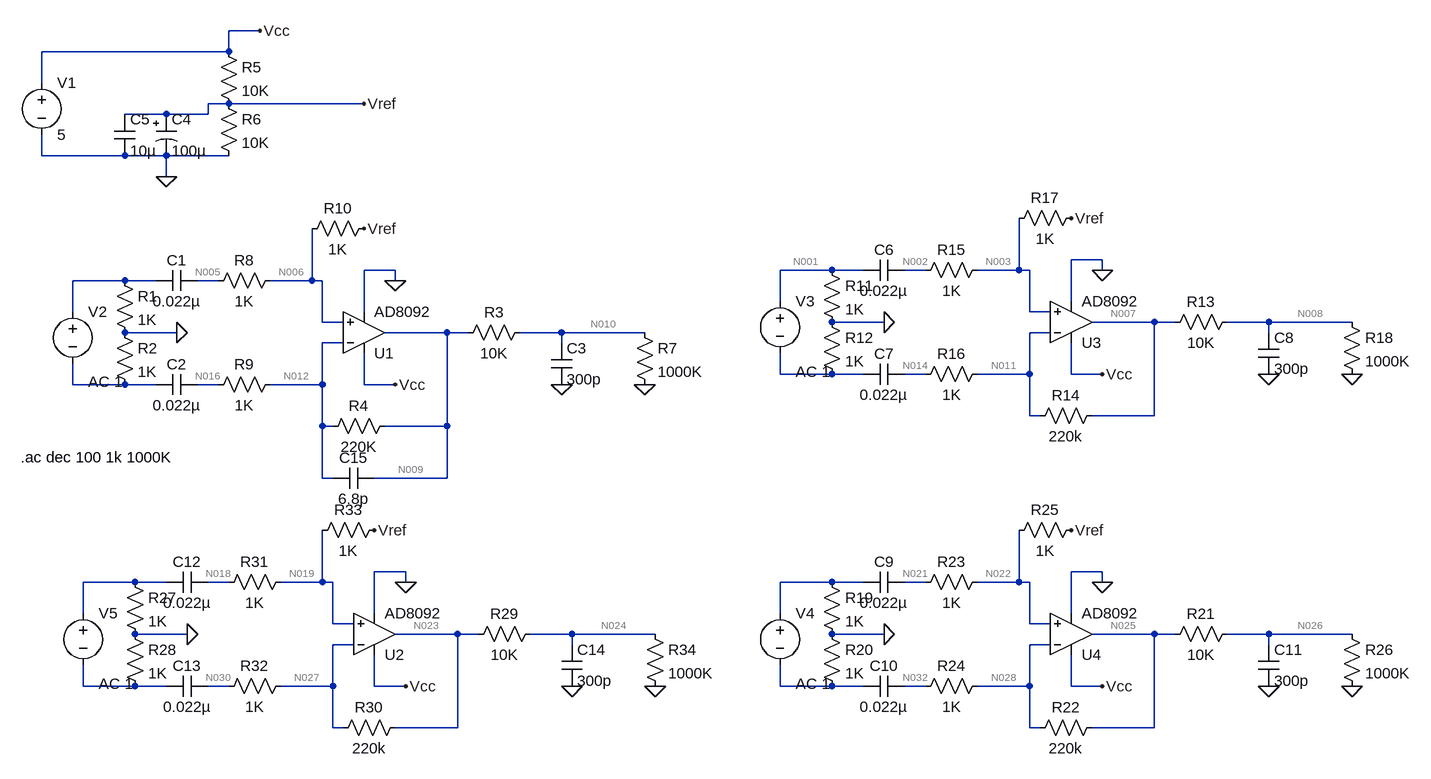
[diagram p0: schematic FilterRC.asc]
FilterRC.asc, the LTspice schematic file:
Version 4
SHEET 1 1920 816
WIRE 144 -304 96 -304
WIRE 96 -272 96 -304
WIRE 96 -272 -192 -272
WIRE -192 -224 -192 -272
WIRE 96 -192 64 -192
WIRE 304 -192 96 -192
WIRE 0 -176 -64 -176
WIRE 64 -176 64 -192
WIRE 64 -176 0 -176
WIRE -192 -112 -192 -144
WIRE -64 -112 -192 -112
WIRE 0 -112 -64 -112
WIRE 96 -112 0 -112
WIRE 0 -80 0 -112
WIRE 1440 48 1392 48
WIRE 352 64 304 64
WIRE 1024 64 944 64
WIRE 1072 64 1024 64
WIRE 1168 64 1136 64
WIRE 1312 64 1312 -16
WIRE 1312 64 1248 64
WIRE 1328 64 1312 64
WIRE 1440 64 1440 48
WIRE -64 80 -144 80
WIRE -16 80 -64 80
WIRE 80 80 48 80
WIRE 224 80 224 0
WIRE 224 80 160 80
WIRE 240 80 224 80
WIRE 352 80 352 64
WIRE 944 112 944 64
WIRE 1392 112 1392 48
WIRE -144 128 -144 80
WIRE 304 128 304 64
WIRE 1328 128 1328 64
WIRE 1360 128 1328 128
WIRE 240 144 240 80
WIRE 272 144 240 144
WIRE 1104 144 1024 144
WIRE 1520 144 1424 144
WIRE 1552 144 1520 144
WIRE 1696 144 1632 144
WIRE 1824 144 1696 144
WIRE 16 160 -64 160
WIRE 432 160 336 160
WIRE 464 160 432 160
WIRE 608 160 544 160
WIRE 736 160 608 160
WIRE 1360 160 1328 160
WIRE 1696 160 1696 144
WIRE 272 176 240 176
WIRE 608 176 608 160
WIRE 944 224 944 192
WIRE 1024 224 944 224
WIRE 1072 224 1024 224
WIRE 1168 224 1136 224
WIRE 1328 224 1328 160
WIRE 1328 224 1248 224
WIRE 1392 224 1392 176
WIRE 1440 224 1392 224
WIRE -144 240 -144 208
WIRE -64 240 -144 240
WIRE -16 240 -64 240
WIRE 80 240 48 240
WIRE 240 240 240 176
WIRE 240 240 160 240
WIRE 304 240 304 192
WIRE 352 240 304 240
WIRE 1328 288 1328 224
WIRE 1344 288 1328 288
WIRE 1520 288 1520 144
WIRE 1520 288 1424 288
WIRE 240 304 240 240
WIRE 256 304 240 304
WIRE 432 304 432 160
WIRE 432 304 336 304
WIRE 240 384 240 304
WIRE 256 384 240 384
WIRE 432 384 432 304
WIRE 432 384 320 384
WIRE 368 528 320 528
WIRE 1440 528 1392 528
WIRE -48 544 -128 544
WIRE 0 544 -48 544
WIRE 96 544 64 544
WIRE 240 544 240 464
WIRE 240 544 176 544
WIRE 256 544 240 544
WIRE 368 544 368 528
WIRE 1024 544 944 544
WIRE 1072 544 1024 544
WIRE 1168 544 1136 544
WIRE 1312 544 1312 464
WIRE 1312 544 1248 544
WIRE 1328 544 1312 544
WIRE 1440 544 1440 528
WIRE -128 592 -128 544
WIRE 320 592 320 528
WIRE 944 592 944 544
WIRE 1392 592 1392 528
WIRE 256 608 256 544
WIRE 288 608 256 608
WIRE 1328 608 1328 544
WIRE 1360 608 1328 608
WIRE 32 624 -48 624
WIRE 448 624 352 624
WIRE 480 624 448 624
WIRE 624 624 560 624
WIRE 752 624 624 624
WIRE 1104 624 1024 624
WIRE 1520 624 1424 624
WIRE 1552 624 1520 624
WIRE 1696 624 1632 624
WIRE 1824 624 1696 624
WIRE 288 640 256 640
WIRE 624 640 624 624
WIRE 1360 640 1328 640
WIRE 1696 640 1696 624
WIRE -128 704 -128 672
WIRE -48 704 -128 704
WIRE 0 704 -48 704
WIRE 96 704 64 704
WIRE 256 704 256 640
WIRE 256 704 176 704
WIRE 320 704 320 656
WIRE 368 704 320 704
WIRE 944 704 944 672
WIRE 1024 704 944 704
WIRE 1072 704 1024 704
WIRE 1168 704 1136 704
WIRE 1328 704 1328 640
WIRE 1328 704 1248 704
WIRE 1392 704 1392 656
WIRE 1440 704 1392 704
WIRE 256 768 256 704
WIRE 272 768 256 768
WIRE 448 768 448 624
WIRE 448 768 352 768
WIRE 1328 768 1328 704
WIRE 1344 768 1328 768
WIRE 1520 768 1520 624
WIRE 1520 768 1424 768
FLAG 0 -80 0
FLAG 16 160 0
FLAG 608 240 0
FLAG 352 80 0
FLAG 144 -304 Vcc
FLAG 352 240 Vcc
FLAG 736 240 0
FLAG 1104 144 0
FLAG 1696 224 0
FLAG 1440 64 0
FLAG 1440 224 Vcc
FLAG 1824 224 0
FLAG 1104 624 0
FLAG 1696 704 0
FLAG 1440 544 0
FLAG 1440 704 Vcc
FLAG 1824 704 0
FLAG 32 624 0
FLAG 624 704 0
FLAG 368 544 0
FLAG 368 704 Vcc
FLAG 752 704 0
FLAG 304 -192 Vref
FLAG 304 0 Vref
FLAG 1392 -16 Vref
FLAG 1392 464 Vref
FLAG 320 464 Vref
SYMBOL res -80 64 R0
SYMATTR InstName R1
SYMATTR Value 1K
SYMATTR SpiceLine tol=1 pwr=0.1
SYMBOL res -80 144 R0
SYMATTR InstName R2
SYMATTR Value 1K
SYMATTR SpiceLine tol=1 pwr=0.1
SYMBOL cap 48 64 R90
WINDOW 0 0 32 VBottom 2
WINDOW 3 32 32 VTop 2
SYMATTR InstName C1
SYMATTR Value 0.022µ
SYMATTR SpiceLine V=16 Irms=21.8m Rser=9.56706 Lser=0
SYMBOL cap 48 224 R90
WINDOW 0 0 32 VBottom 2
WINDOW 3 32 32 VTop 2
SYMATTR InstName C2
SYMATTR Value 0.022µ
SYMATTR SpiceLine V=16 Irms=21.8m Rser=9.56706 Lser=0
SYMBOL cap 592 176 R0
SYMATTR InstName C3
SYMATTR Value 300p
SYMATTR SpiceLine V=16 Irms=459m Rser=0.256209 Lser=0
SYMBOL polcap -16 -176 R0
WINDOW 3 24 56 Left 2
SYMATTR Value 100µ
SYMATTR InstName C4
SYMATTR Description Capacitor
SYMATTR Type cap
SYMATTR SpiceLine V=6.3 Irms=150m Rser=0.85 Lser=0 mfg="Nichicon" pn="UPL0J101MAH" type="Al electrolytic"
SYMBOL cap -80 -176 R0
SYMATTR InstName C5
SYMATTR Value 10µ
SYMATTR SpiceLine V=25 Irms=8.06 Rser=0.00577565 Lser=0 mfg="KEMET" pn="C1210C106K3PAC" type="X5R"
SYMBOL res 560 144 R90
WINDOW 0 0 56 VBottom 2
WINDOW 3 32 56 VTop 2
SYMATTR InstName R3
SYMATTR Value 10K
SYMATTR SpiceLine tol=1 pwr=0.1
SYMBOL res 352 288 R90
WINDOW 0 0 56 VBottom 2
WINDOW 3 32 56 VTop 2
SYMATTR InstName R4
SYMATTR Value 220K
SYMATTR SpiceLine tol=1 pwr=0.1
SYMBOL res 80 -288 R0
SYMATTR InstName R5
SYMATTR Value 10K
SYMATTR SpiceLine tol=1 pwr=0.1
SYMBOL res 80 -208 R0
SYMATTR InstName R6
SYMATTR Value 10K
SYMATTR SpiceLine tol=1 pwr=0.1
SYMBOL voltage -192 -240 R0
WINDOW 123 0 0 Left 2
WINDOW 39 0 0 Left 2
SYMATTR InstName V1
SYMATTR Value 5
SYMBOL voltage -144 112 R0
WINDOW 123 24 124 Left 2
WINDOW 39 0 0 Left 2
SYMATTR Value2 AC 1
SYMATTR InstName V2
SYMATTR Value ""
SYMBOL res 176 64 R90
WINDOW 0 0 56 VBottom 2
WINDOW 3 32 56 VTop 2
SYMATTR InstName R8
SYMATTR Value 1K
SYMATTR SpiceLine tol=1 pwr=0.1
SYMBOL res 176 224 R90
WINDOW 0 0 56 VBottom 2
WINDOW 3 32 56 VTop 2
SYMATTR InstName R9
SYMATTR Value 1K
SYMATTR SpiceLine tol=1 pwr=0.1
SYMBOL res 320 -16 R90
WINDOW 0 0 56 VBottom 2
WINDOW 3 32 56 VTop 2
SYMATTR InstName R10
SYMATTR Value 1K
SYMATTR SpiceLine tol=1 pwr=0.1
SYMBOL res 720 144 R0
SYMATTR InstName R7
SYMATTR Value 1000K
SYMBOL res 1008 48 R0
SYMATTR InstName R11
SYMATTR Value 1K
SYMATTR SpiceLine tol=1 pwr=0.1
SYMBOL res 1008 128 R0
SYMATTR InstName R12
SYMATTR Value 1K
SYMATTR SpiceLine tol=1 pwr=0.1
SYMBOL cap 1136 48 R90
WINDOW 0 0 32 VBottom 2
WINDOW 3 32 32 VTop 2
SYMATTR InstName C6
SYMATTR Value 0.022µ
SYMATTR SpiceLine V=16 Irms=21.8m Rser=9.56706 Lser=0
SYMBOL cap 1136 208 R90
WINDOW 0 0 32 VBottom 2
WINDOW 3 32 32 VTop 2
SYMATTR InstName C7
SYMATTR Value 0.022µ
SYMATTR SpiceLine V=16 Irms=21.8m Rser=9.56706 Lser=0
SYMBOL cap 1680 160 R0
SYMATTR InstName C8
SYMATTR Value 300p
SYMATTR SpiceLine V=16 Irms=459m Rser=0.256209 Lser=0
SYMBOL res 1648 128 R90
WINDOW 0 0 56 VBottom 2
WINDOW 3 32 56 VTop 2
SYMATTR InstName R13
SYMATTR Value 10K
SYMATTR SpiceLine tol=1 pwr=0.1
SYMBOL res 1440 272 R90
WINDOW 0 0 56 VBottom 2
WINDOW 3 32 56 VTop 2
SYMATTR InstName R14
SYMATTR Value 220k
SYMATTR SpiceLine tol=1 pwr=0.1
SYMBOL voltage 944 96 R0
WINDOW 123 24 124 Left 2
WINDOW 39 0 0 Left 2
SYMATTR Value2 AC 1
SYMATTR InstName V3
SYMATTR Value ""
SYMBOL res 1264 48 R90
WINDOW 0 0 56 VBottom 2
WINDOW 3 32 56 VTop 2
SYMATTR InstName R15
SYMATTR Value 1K
SYMATTR SpiceLine tol=1 pwr=0.1
SYMBOL res 1264 208 R90
WINDOW 0 0 56 VBottom 2
WINDOW 3 32 56 VTop 2
SYMATTR InstName R16
SYMATTR Value 1K
SYMATTR SpiceLine tol=1 pwr=0.1
SYMBOL res 1408 -32 R90
WINDOW 0 0 56 VBottom 2
WINDOW 3 32 56 VTop 2
SYMATTR InstName R17
SYMATTR Value 1K
SYMATTR SpiceLine tol=1 pwr=0.1
SYMBOL res 1808 128 R0
SYMATTR InstName R18
SYMATTR Value 1000K
SYMBOL res 1008 528 R0
SYMATTR InstName R19
SYMATTR Value 1K
SYMATTR SpiceLine tol=1 pwr=0.1
SYMBOL res 1008 608 R0
SYMATTR InstName R20
SYMATTR Value 1K
SYMATTR SpiceLine tol=1 pwr=0.1
SYMBOL cap 1136 528 R90
WINDOW 0 0 32 VBottom 2
WINDOW 3 32 32 VTop 2
SYMATTR InstName C9
SYMATTR Value 0.022µ
SYMATTR SpiceLine V=16 Irms=21.8m Rser=9.56706 Lser=0
SYMBOL cap 1136 688 R90
WINDOW 0 0 32 VBottom 2
WINDOW 3 32 32 VTop 2
SYMATTR InstName C10
SYMATTR Value 0.022µ
SYMATTR SpiceLine V=16 Irms=21.8m Rser=9.56706 Lser=0
SYMBOL cap 1680 640 R0
SYMATTR InstName C11
SYMATTR Value 300p
SYMATTR SpiceLine V=16 Irms=459m Rser=0.256209 Lser=0
SYMBOL res 1648 608 R90
WINDOW 0 0 56 VBottom 2
WINDOW 3 32 56 VTop 2
SYMATTR InstName R21
SYMATTR Value 10K
SYMATTR SpiceLine tol=1 pwr=0.1
SYMBOL res 1440 752 R90
WINDOW 0 0 56 VBottom 2
WINDOW 3 32 56 VTop 2
SYMATTR InstName R22
SYMATTR Value 220k
SYMATTR SpiceLine tol=1 pwr=0.1
SYMBOL voltage 944 576 R0
WINDOW 123 24 124 Left 2
WINDOW 39 0 0 Left 2
SYMATTR Value2 AC 1
SYMATTR InstName V4
SYMATTR Value ""
SYMBOL res 1264 528 R90
WINDOW 0 0 56 VBottom 2
WINDOW 3 32 56 VTop 2
SYMATTR InstName R23
SYMATTR Value 1K
SYMATTR SpiceLine tol=1 pwr=0.1
SYMBOL res 1264 688 R90
WINDOW 0 0 56 VBottom 2
WINDOW 3 32 56 VTop 2
SYMATTR InstName R24
SYMATTR Value 1K
SYMATTR SpiceLine tol=1 pwr=0.1
SYMBOL res 1408 448 R90
WINDOW 0 0 56 VBottom 2
WINDOW 3 32 56 VTop 2
SYMATTR InstName R25
SYMATTR Value 1K
SYMATTR SpiceLine tol=1 pwr=0.1
SYMBOL res 1808 608 R0
SYMATTR InstName R26
SYMATTR Value 1000K
SYMBOL res -64 528 R0
SYMATTR InstName R27
SYMATTR Value 1K
SYMATTR SpiceLine tol=1 pwr=0.1
SYMBOL res -64 608 R0
SYMATTR InstName R28
SYMATTR Value 1K
SYMATTR SpiceLine tol=1 pwr=0.1
SYMBOL cap 64 528 R90
WINDOW 0 0 32 VBottom 2
WINDOW 3 32 32 VTop 2
SYMATTR InstName C12
SYMATTR Value 0.022µ
SYMATTR SpiceLine V=16 Irms=21.8m Rser=9.56706 Lser=0
SYMBOL cap 64 688 R90
WINDOW 0 0 32 VBottom 2
WINDOW 3 32 32 VTop 2
SYMATTR InstName C13
SYMATTR Value 0.022µ
SYMATTR SpiceLine V=16 Irms=21.8m Rser=9.56706 Lser=0
SYMBOL cap 608 640 R0
SYMATTR InstName C14
SYMATTR Value 300p
SYMATTR SpiceLine V=16 Irms=459m Rser=0.256209 Lser=0
SYMBOL res 576 608 R90
WINDOW 0 0 56 VBottom 2
WINDOW 3 32 56 VTop 2
SYMATTR InstName R29
SYMATTR Value 10K
SYMATTR SpiceLine tol=1 pwr=0.1
SYMBOL res 368 752 R90
WINDOW 0 0 56 VBottom 2
WINDOW 3 32 56 VTop 2
SYMATTR InstName R30
SYMATTR Value 220k
SYMATTR SpiceLine tol=1 pwr=0.1
SYMBOL voltage -128 576 R0
WINDOW 123 24 124 Left 2
WINDOW 39 0 0 Left 2
SYMATTR Value2 AC 1
SYMATTR InstName V5
SYMATTR Value ""
SYMBOL res 192 528 R90
WINDOW 0 0 56 VBottom 2
WINDOW 3 32 56 VTop 2
SYMATTR InstName R31
SYMATTR Value 1K
SYMATTR SpiceLine tol=1 pwr=0.1
SYMBOL res 192 688 R90
WINDOW 0 0 56 VBottom 2
WINDOW 3 32 56 VTop 2
SYMATTR InstName R32
SYMATTR Value 1K
SYMATTR SpiceLine tol=1 pwr=0.1
SYMBOL res 336 448 R90
WINDOW 0 0 56 VBottom 2
WINDOW 3 32 56 VTop 2
SYMATTR InstName R33
SYMATTR Value 1K
SYMATTR SpiceLine tol=1 pwr=0.1
SYMBOL res 736 608 R0
SYMATTR InstName R34
SYMATTR Value 1000K
SYMBOL Opamps\\AD8092 304 224 M180
SYMATTR InstName U1
SYMBOL Opamps\\AD8092 320 688 M180
SYMATTR InstName U2
SYMBOL Opamps\\AD8092 1392 208 M180
SYMATTR InstName U3
SYMBOL Opamps\\AD8092 1392 688 M180
SYMATTR InstName U4
SYMBOL cap 320 368 R90
WINDOW 0 0 32 VBottom 2
WINDOW 3 32 32 VTop 2
SYMATTR InstName C15
SYMATTR Value 6.8p
SYMATTR SpiceLine V=16 Irms=21.8m Rser=9.56706 Lser=0
TEXT -224 352 Left 2 !.ac dec 100 1k 1000K

The netlist it stands for:
* FilterRC.asc
R1 N004 0 1K tol=1 pwr=0.1
R2 0 N015 1K tol=1 pwr=0.1
C1 N005 N004 0.022µ V=16 Irms=21.8m Rser=9.56706 Lser=0
C2 N016 N015 0.022µ V=16 Irms=21.8m Rser=9.56706 Lser=0
C3 N010 0 300p V=16 Irms=459m Rser=0.256209 Lser=0
C4 Vref 0 100µ V=6.3 Irms=150m Rser=0.85 Lser=0 mfg="Nichicon" pn="UPL0J101MAH" type="Al electrolytic"
C5 Vref 0 10µ V=25 Irms=8.06 Rser=0.00577565 Lser=0 mfg="KEMET" pn="C1210C106K3PAC" type="X5R"
R3 N010 N009 10K tol=1 pwr=0.1
R4 N009 N012 220K tol=1 pwr=0.1
R5 Vcc Vref 10K tol=1 pwr=0.1
R6 Vref 0 10K tol=1 pwr=0.1
V1 Vcc 0 5
V2 N004 N015 AC 1
R8 N006 N005 1K tol=1 pwr=0.1
R9 N012 N016 1K tol=1 pwr=0.1
R10 Vref N006 1K tol=1 pwr=0.1
R7 N010 0 1000K
R11 N001 0 1K tol=1 pwr=0.1
R12 0 N013 1K tol=1 pwr=0.1
C6 N002 N001 0.022µ V=16 Irms=21.8m Rser=9.56706 Lser=0
C7 N014 N013 0.022µ V=16 Irms=21.8m Rser=9.56706 Lser=0
C8 N008 0 300p V=16 Irms=459m Rser=0.256209 Lser=0
R13 N008 N007 10K tol=1 pwr=0.1
R14 N007 N011 220k tol=1 pwr=0.1
V3 N001 N013 AC 1
R15 N003 N002 1K tol=1 pwr=0.1
R16 N011 N014 1K tol=1 pwr=0.1
R17 Vref N003 1K tol=1 pwr=0.1
R18 N008 0 1000K
R19 N020 0 1K tol=1 pwr=0.1
R20 0 N031 1K tol=1 pwr=0.1
C9 N021 N020 0.022µ V=16 Irms=21.8m Rser=9.56706 Lser=0
C10 N032 N031 0.022µ V=16 Irms=21.8m Rser=9.56706 Lser=0
C11 N026 0 300p V=16 Irms=459m Rser=0.256209 Lser=0
R21 N026 N025 10K tol=1 pwr=0.1
R22 N025 N028 220k tol=1 pwr=0.1
V4 N020 N031 AC 1
R23 N022 N021 1K tol=1 pwr=0.1
R24 N028 N032 1K tol=1 pwr=0.1
R25 Vref N022 1K tol=1 pwr=0.1
R26 N026 0 1000K
R27 N017 0 1K tol=1 pwr=0.1
R28 0 N029 1K tol=1 pwr=0.1
C12 N018 N017 0.022µ V=16 Irms=21.8m Rser=9.56706 Lser=0
C13 N030 N029 0.022µ V=16 Irms=21.8m Rser=9.56706 Lser=0
C14 N024 0 300p V=16 Irms=459m Rser=0.256209 Lser=0
R29 N024 N023 10K tol=1 pwr=0.1
R30 N023 N027 220k tol=1 pwr=0.1
V5 N017 N029 AC 1
R31 N019 N018 1K tol=1 pwr=0.1
R32 N027 N030 1K tol=1 pwr=0.1
R33 Vref N019 1K tol=1 pwr=0.1
R34 N024 0 1000K
XU1 N006 N012 Vcc 0 N009 AD8092  ; pins In+ In- V+ V- OUT
XU2 N019 N027 Vcc 0 N023 AD8092  ; pins In+ In- V+ V- OUT
XU3 N003 N011 Vcc 0 N007 AD8092  ; pins In+ In- V+ V- OUT
XU4 N022 N028 Vcc 0 N025 AD8092  ; pins In+ In- V+ V- OUT
C15 N009 N012 6.8p V=16 Irms=21.8m Rser=9.56706 Lser=0
.ac dec 100 1k 1000K
.backanno
.end

* Results of the author's LTspice run, read from the files saved beside the schematic
* Operating Point, zero values left out:
*   V(n005) = 2.506 V
*   V(n016) = 2.508 V
*   V(n010) = 2.38 V
*   V(vref) = 2.505 V
*   V(n009) = 2.403 V
*   V(n012) = 2.508 V
*   V(vcc) = 5 V
*   V(n006) = 2.506 V
*   V(n002) = 2.506 V
*   V(n014) = 2.508 V
*   V(n008) = 2.38 V
*   V(n007) = 2.403 V
*   V(n011) = 2.508 V
*   V(n003) = 2.506 V
*   V(n021) = 2.506 V
*   V(n032) = 2.508 V
*   V(n026) = 2.38 V
*   V(n025) = 2.403 V
*   V(n028) = 2.508 V
*   V(n022) = 2.506 V
*   V(n018) = 2.506 V
*   V(n030) = 2.508 V
*   V(n024) = 2.38 V
*   V(n023) = 2.403 V
*   V(n027) = 2.508 V
*   V(n019) = 2.506 V
*   I(R34) = 2.38 µA
*   I(R33) = -273.9 nA
*   I(R30) = -473.9 nA
*   I(R29) = -2.38 µA
*   I(R26) = 2.38 µA
*   I(R25) = -273.9 nA
*   I(R22) = -473.9 nA
*   I(R21) = -2.38 µA
*   I(R18) = 2.38 µA
*   I(R17) = -273.9 nA
*   I(R14) = -473.9 nA
*   I(R13) = -2.38 µA
*   I(R7) = 2.38 µA
*   I(R10) = -273.9 nA
*   I(R6) = 250.5 µA
*   I(R5) = 249.5 µA
*   I(R4) = -473.9 nA
*   I(R3) = -2.38 µA
*   I(V1) = -6.361 mA
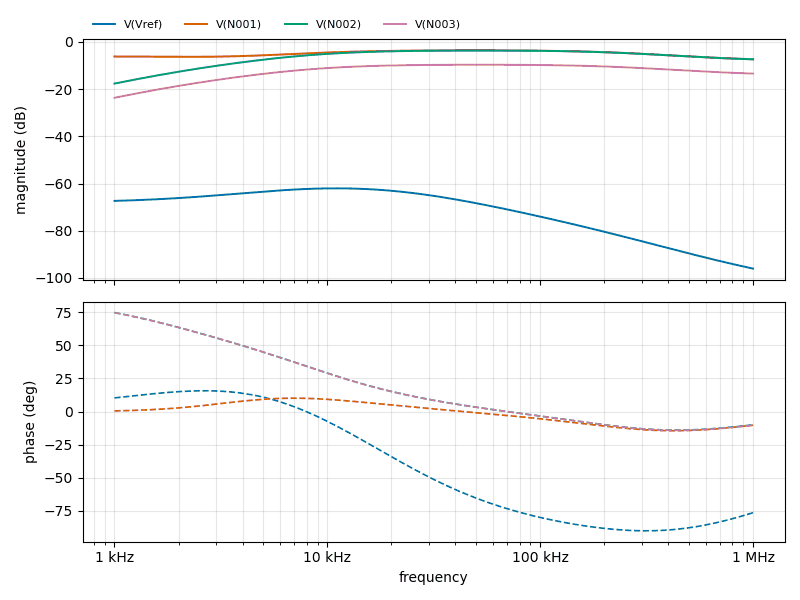
[diagram p1: AC Analysis of FilterRC.asc, plotted from the saved traces]
* AC Analysis, 1 run:
*   V(Vref): -67.34 dB at 1 kHz, -96.04 dB at 1 MHz, peak -62.02 dB at 10.96 kHz, 3 dB below the peak at 2.989 kHz and 30.62 kHz
*   V(N001): -6.15 dB at 1 kHz, -7.31 dB at 1 MHz, peak -3.55 dB at 47.86 kHz, 3 dB below the peak at 619.5 kHz
*   V(N002): -17.64 dB at 1 kHz, -7.35 dB at 1 MHz, peak -3.61 dB at 52.48 kHz, 3 dB below the peak at 6.137 kHz and 626.8 kHz
*   V(N003): -23.65 dB at 1 kHz, -13.38 dB at 1 MHz, peak -9.63 dB at 51.29 kHz, 3 dB below the peak at 6.122 kHz and 623.3 kHz